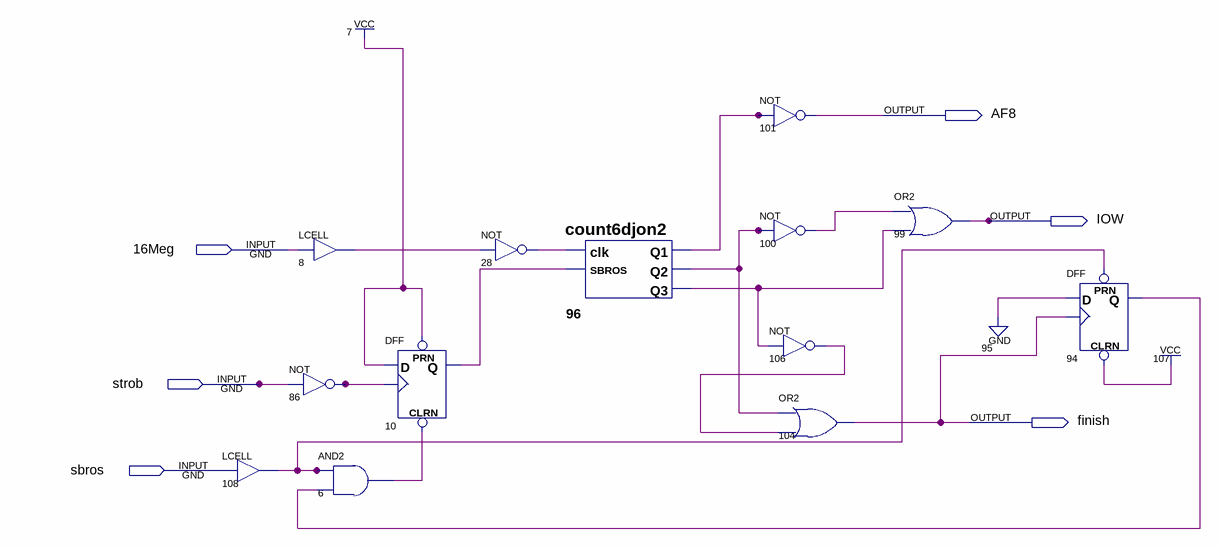
[diagram p0: schematic sheet]
// Quartus schematic af8okt13now.bdf as structural Verilog: 13 symbols, 6 pins
module af8okt13now (
  input  \16Meg ,
  input  strob,
  input  sbros,
  output AF8,
  output IOW,
  output finish
);

  wire n6_out, n8_out, n10_q, n28_out, n86_out, n94_q, n96_q1, n96_q2, n96_q3, n100_out, n106_out, n108_out;

  LCELL u_108 (.IN(sbros), .OUT(n108_out));
  LCELL u_8 (.IN(\16Meg ), .OUT(n8_out));
  not u_86 (n86_out, strob);
  and u_6 (n6_out, n108_out, n94_q);
  DFF u_10 (.CLRN(n6_out), .CLK(n86_out), .D(1'b1), .PRN(1'b1), .Q(n10_q));
  not u_28 (n28_out, n8_out);
  count6djon2 u_96 (.clk(n28_out), .SBROS(n10_q), .Q1(n96_q1), .Q2(n96_q2), .Q3(n96_q3));
  not u_101 (AF8, n96_q1);
  not u_100 (n100_out, n96_q2);
  not u_106 (n106_out, n96_q3);
  or u_104 (finish, n96_q2, n106_out);
  or u_99 (IOW, n100_out, n96_q3);
  DFF u_94 (.CLRN(1'b1), .CLK(finish), .D(1'b0), .PRN(n108_out), .Q(n94_q));
endmodule
